# EAGLE schematic Capsense (EAGLE 6.4)
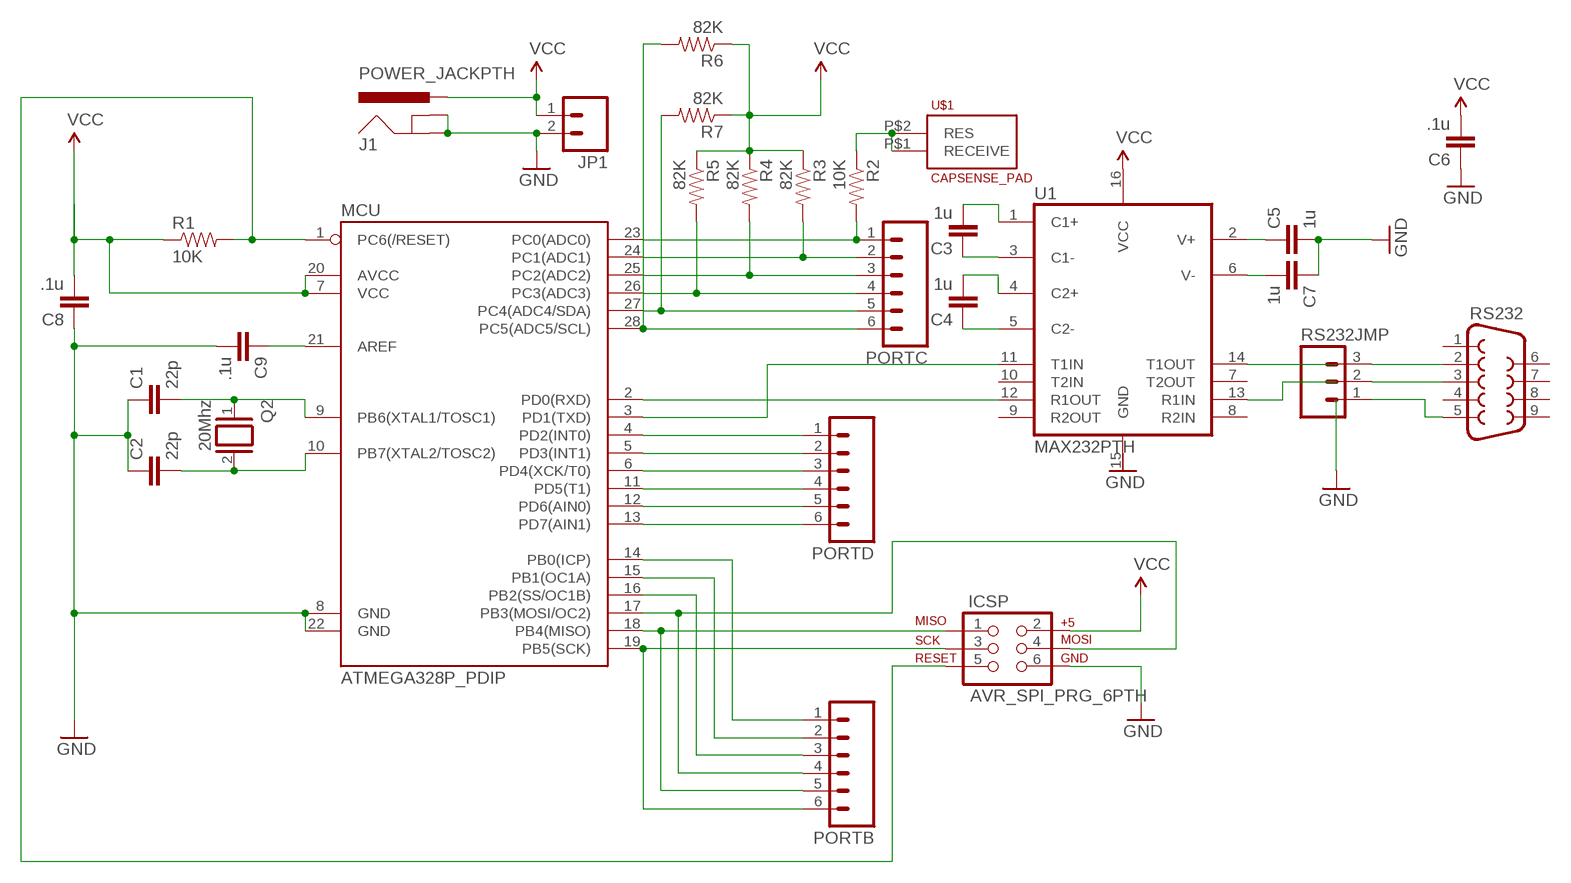
[diagram p0: schematic, sheet 1]

## Parts
C1  22p  CAP_  [AXIAL-5MM]
C2  22p  CAP_  [AXIAL-5MM]
C3  1u  CAP_  [AXIAL-5MM]
C4  1u  CAP_  [AXIAL-5MM]
C5  1u  CAP_  [AXIAL-5MM]
C6  .1u  CAP_  [AXIAL-5MM]
C7  1u  CAP_  [AXIAL-5MM]
C8  .1u  CAP_  [AXIAL-5MM]
C9  .1u  CAP_  [AXIAL-5MM]
ICSP  AVR_SPI_PRG_6PTH  [2X3]
J1  POWER_JACKPTH  [POWER_JACK_PTH]
JP1  M02PTH  [1X02]
MCU  ATMEGA328P_PDIP  [DIL28-3]
PORTB  M06SIP  [1X06]
PORTC  M06SIP  [1X06]
PORTD  M06SIP  [1X06]
Q2  20Mhz  XTAL/S  [QS]
R1  10K  RESISTORAXIAL-0.3  [AXIAL-0.3]
R2  10K  RESISTORAXIAL-0.3  [AXIAL-0.3]
R3  82K  RESISTORAXIAL-0.3  [AXIAL-0.3]
R4  82K  RESISTORAXIAL-0.3  [AXIAL-0.3]
R5  82K  RESISTORAXIAL-0.3  [AXIAL-0.3]
R6  82K  RESISTORAXIAL-0.3  [AXIAL-0.3]
R7  82K  RESISTORAXIAL-0.3  [AXIAL-0.3]
RS232  DB9FEMALE  [DB9]
RS232JMP  M03PTH  [1X03]
U1  MAX232PTH  [DIL16]
U$1  CAPSENSE_PAD  [CAPSENSE_PAD]

## Nets
GND: C1.P$1 C2.P$1 C5.P$2 C6.P$1 C7.P$1 C8.P$1 C9.P$2 ICSP.6 J1.GND J1.GNDBREAK JP1.2 MCU.8(GND) MCU.22(GND)
N$1: ICSP.3 MCU.19(PB5(SCK)) PORTB.6
N$2: ICSP.1 MCU.18(PB4(MISO)) PORTB.5
N$3: ICSP.4 MCU.17(PB3(MOSI/OC2)) PORTB.4
N$4: U1.14(T1OUT)
N$5: C2.P$2 MCU.10(PB7(XTAL2/TOSC2)) Q2.2
N$6: C1.P$2 MCU.9(PB6(XTAL1/TOSC1)) Q2.1
N$7: C3.P$1 U1.3(C1-)
N$8: C3.P$2 U1.1(C1+)
N$9: C4.P$2 U1.4(C2+)
N$10: C4.P$1 U1.5(C2-)
N$11: C5.P$1 U1.2(V+)
N$12: C7.P$2 U1.6(V-)
N$13: ICSP.5 MCU.1(PC6(/RESET)) R1.P$2
N$14: U1.13(R1IN)
N$15: MCU.2(PD0(RXD)) U1.12(R1OUT)
N$16: MCU.3(PD1(TXD)) U1.11(T1IN)
N$17: MCU.28(PC5(ADC5/SCL)) PORTC.6 R6.P$2
N$18: MCU.27(PC4(ADC4/SDA)) PORTC.5 R7.P$2
N$19: C9.P$1 MCU.21(AREF)
N$20: MCU.26(PC3(ADC3)) PORTC.4 R5.P$2
N$21: MCU.25(PC2(ADC2)) PORTC.3 R4.P$2
N$22: MCU.24(PC1(ADC1)) PORTC.2 R3.P$2
N$23: MCU.23(PC0(ADC0)) PORTC.1 R2.P$2
N$24: MCU.4(PD2(INT0)) PORTD.1
N$25: MCU.5(PD3(INT1)) PORTD.2
N$26: MCU.6(PD4(XCK/T0)) PORTD.3
N$27: MCU.11(PD5(T1)) PORTD.4
N$28: MCU.12(PD6(AIN0)) PORTD.5
N$29: MCU.13(PD7(AIN1)) PORTD.6
N$30: MCU.16(PB2(SS/OC1B)) PORTB.3
N$31: MCU.15(PB1(OC1A)) PORTB.2
N$32: MCU.14(PB0(ICP)) PORTB.1
N$33: RS232.3 RS232JMP.2
N$34: R2.P$1 U$1.P$1(RECEIVE) U$1.P$2(RES)
N$36: RS232.2 RS232JMP.3
N$37: RS232.5 RS232JMP.1
VCC: C6.P$2 C8.P$2 ICSP.2 J1.PWR JP1.1 MCU.7(VCC) MCU.20(AVCC) R1.P$1 R3.P$1 R4.P$1 R5.P$1 R6.P$1 R7.P$1 U1.16(VCC)
Unconnected: RS232.1 RS232.4 RS232.6 RS232.7 RS232.8 RS232.9 U1.7(T2OUT) U1.8(R2IN) U1.9(R2OUT) U1.10(T2IN) U1.15(GND)

## Library data of the parts
C1-C9 = SparkFun-Passives:CAP: Capacitor Standard 0603 ceramic capacitor, and 0.1" leaded capacitor.
ICSP = SparkFun-Connectors:AVR_SPI_PRG_6: AVR ISP 6 Pin This is the reduced ISP connector for AVR programming. Common on Arduino. This footprint will take up less PCB space and can be used with a 10-pin to 6-pin adapter such as SKU: BOB-08508
J1 = SparkFun-Connectors:POWER_JACK: Power Jack This is the standard 5.5mm barrel jack for power. The PTH is the most common, proven, reliable, footprint. The Slot footprint only works if the mill layer is transmitted to the PCB fab house so be warned. Spark Fun Electronics SKU : PRT-00119 SMT: CONN-08106 Mating wall wart : TOL-00298 (and others)
JP1 = SparkFun-Connectors:M02: Header 2 Standard 2-pin 0.1" header. Use with straight break away headers (SKU : PRT-00116), right angle break away headers (PRT-00553), swiss pins (PRT-00743), machine pins (PRT-00117), and female headers (PRT-00115). Molex polarized connector foot print use with SKU : PRT-08233 with associated crimp pins and housings.
MCU = SparkFun-DigitalIC:ATMEGA328P_PDIP: uC used in the Arduino 32kb flash, 1k EEPROM, 2k SRAM This is the through-hole version of this chip.
PORTB PORTC PORTD = SparkFun-Connectors:M06: Header 6 Standard 6-pin 0.1" header. Use with straight break away headers (SKU : PRT-00116), right angle break away headers (PRT-00553), swiss pins (PRT-00743), machine pins (PRT-00117), and female headers (PRT-00115). Molex polarized connector foot print use with SKU : PRT-08094 with associated crimp pins and housings. NOTES ON THE VARIANTS LOCK and LOCK_LONGPADS... This footprint was designed to help hold the alignment of a through-hole component (i.e. 6-pin header) while soldering it into place. You may notice that each hole has been shifted either up or down by 0.005 of an inch from it's more standard position (which is a perfectly straight line). This slight alteration caused the pins (the squares in the middle) to touch the edges of the holes. Because they are alternating, it causes a "brace" to hold the component in place. 0.005 has proven to be the perfect amount of "off-center" position when using our standard breakaway headers. Although looks a little odd when you look at the bare footprint, once you have a header in there, the alteration is very hard to notice. Also, if you push a header all the way into place, it is covered up entirely on the bottom side. This idea of altering the position of holes to aid alignment will be further integrated into the Sparkfun Library for other footprints. It can help hold any component with 3 or more connection pins.
Q2 = special:XTAL/S: CRYSTAL
R1-R7 = SparkFun-Passives:RESISTOR: Resistor Basic schematic elements and footprints for 0603, 1206, and PTH resistors.
RS232 = SparkFun-Connectors:DB9: DB9 Connector Standard DB9 (D-Sub 9) serial connector. Can be used for CAN bus as well as RS485 and RS232. Footprint production proven. Spark Fun Electronics SKU : PRT-00429
RS232JMP = SparkFun-Connectors:M03: Header 3 Standard 3-pin 0.1" header. Use with straight break away headers (SKU : PRT-00116), right angle break away headers (PRT-00553), swiss pins (PRT-00743), machine pins (PRT-00117), and female headers (PRT-00115). Molex polarized connector foot print use with SKU : PRT-08232 with associated crimp pins and housings.
U1 = SparkFun-DigitalIC:MAX232: RS232 Transceiver Very common IC. This is generically called 'MAX232', but works with the 3V equivalent MAX3232 generic ICs. Field tested and mother approved. Spark Fun Electronics SKU : COM-00316 (DIP) and COM-00589 (SMD)
U$1 = SparkFun-Electromechanical:CAPSENSE_PAD: Generic copper pad for a capacitive touch sensor.